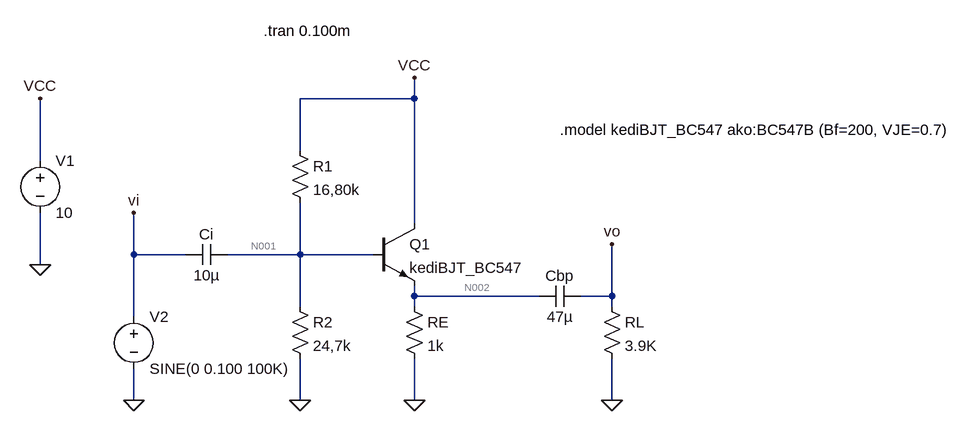
[diagram p0: schematic exp62.asc]
exp62.asc, the LTspice schematic file:
Version 4
SHEET 1 1048 680
WIRE 32 -160 32 -192
WIRE 32 -160 -144 -160
WIRE -144 -80 -144 -160
WIRE -544 -64 -544 -160
WIRE 32 32 32 -160
WIRE -400 80 -400 16
WIRE -320 80 -400 80
WIRE -144 80 -144 0
WIRE -144 80 -256 80
WIRE -32 80 -144 80
WIRE -544 96 -544 16
WIRE 32 144 32 128
WIRE 224 144 32 144
WIRE 336 144 336 64
WIRE 336 144 288 144
WIRE -144 160 -144 80
WIRE 32 160 32 144
WIRE 336 160 336 144
WIRE -400 176 -400 80
WIRE -400 304 -400 256
WIRE -144 304 -144 240
WIRE 32 304 32 240
WIRE 336 304 336 240
FLAG -544 96 0
FLAG -544 -160 VCC
FLAG 32 -192 VCC
FLAG -144 304 0
FLAG 32 304 0
FLAG -400 304 0
FLAG -400 16 vi
FLAG 336 304 0
FLAG 336 64 vo
SYMBOL npn -32 32 R0
SYMATTR InstName Q1
SYMATTR Value kediBJT_BC547
SYMBOL voltage -544 -80 R0
WINDOW 123 0 0 Left 0
WINDOW 39 0 0 Left 0
SYMATTR InstName V1
SYMATTR Value 10
SYMBOL res -160 -96 R0
SYMATTR InstName R1
SYMATTR Value 16,80k
SYMBOL res 16 144 R0
SYMATTR InstName RE
SYMATTR Value 1k
SYMBOL res -160 144 R0
SYMATTR InstName R2
SYMATTR Value 24,7k
SYMBOL cap -256 64 R90
WINDOW 0 0 32 VBottom 2
WINDOW 3 32 32 VTop 2
SYMATTR InstName Ci
SYMATTR Value 10µ
SYMBOL voltage -400 160 R0
WINDOW 123 0 0 Left 0
WINDOW 39 0 0 Left 0
SYMATTR InstName V2
SYMATTR Value SINE(0 0.100 100K)
SYMBOL cap 288 128 R90
WINDOW 0 0 32 VBottom 2
WINDOW 3 32 32 VTop 2
SYMATTR InstName Cbp
SYMATTR Value 47µ
SYMBOL res 320 144 R0
SYMATTR InstName RL
SYMATTR Value 3.9K
TEXT 256 -112 Left 2 !.model kediBJT_BC547 ako:BC547B (Bf=200, VJE=0.7)
TEXT -200 -264 Left 2 !.tran 0.100m

The netlist it stands for:
* exp62.asc
Q1 VCC N001 N002 0 kediBJT_BC547
V1 VCC 0 10
R1 VCC N001 16,80k
RE N002 0 1k
R2 N001 0 24,7k
Ci N001 vi 10µ
V2 vi 0 SINE(0 0.100 100K)
Cbp vo N002 47µ
RL vo 0 3.9K
.model NPN NPN
.model PNP PNP
.lib standard.bjt
.model kediBJT_BC547 ako:BC547B (Bf=200, VJE=0.7)
.tran 0.100m
.backanno
.end

* Results of the author's LTspice run, read from the files saved beside the schematic
* Operating Point, zero values left out:
*   V(vcc) = 10 V
*   V(n001) = 798.7 mV
*   V(n002) = 205.3 mV
*   Ic(Q1) = 204.4 µA
*   Ib(Q1) = 921.8 nA
*   Ie(Q1) = -205.3 µA
*   I(R2) = 114.1 µA
*   I(Re) = 205.3 µA
*   I(R1) = 115 µA
*   I(V1) = -319.4 µA
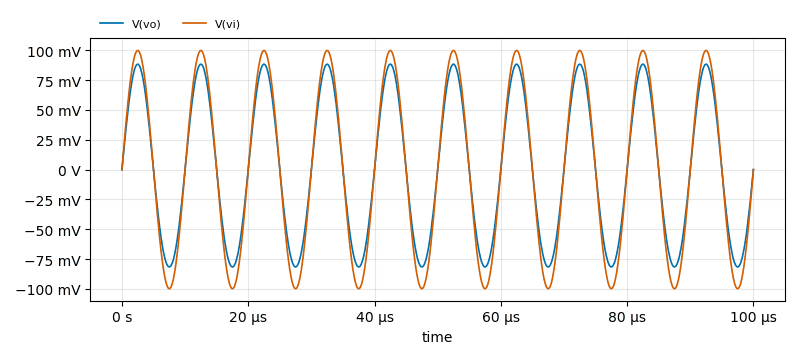
[diagram p1: Transient Analysis of exp62.asc, plotted from the saved traces]
* Transient Analysis, 1 run:
*   V(vo): min -81.7 mV, max 88.5 mV, average 1.661 mV, rms 60.38 mV, last 26.28 µV
*   V(vi): min -99.98 mV, max 100 mV, average -465 nV, rms 70.7 mV, last 0 V